# EAGLE schematic Divider (EAGLE 9.1.3)
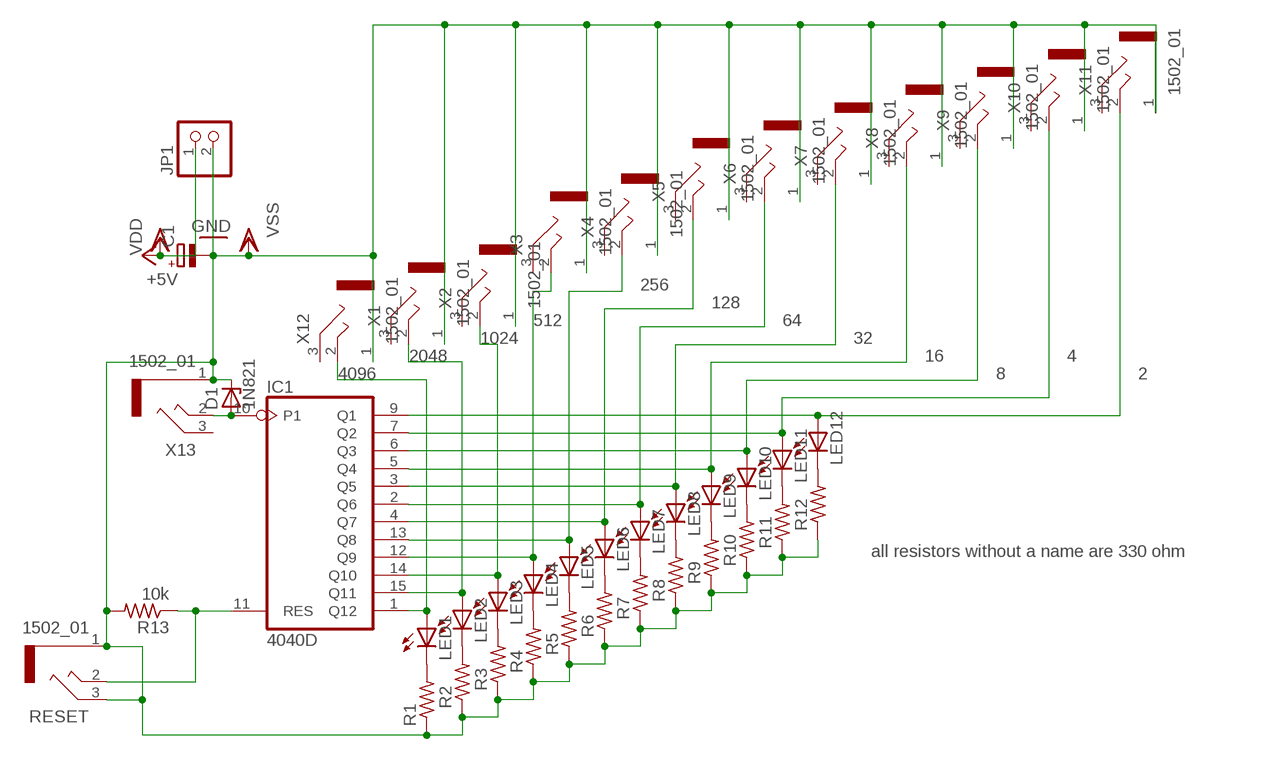
[diagram p0: schematic, sheet 1]

## Parts
C1  CPOL-EUE2,5-6E  [E2,5-6E]
D1  1N821  [DO35Z10]
IC1  4040D  [SO16]
JP1  PINHD-1X2  [1X02]
LED1  LED5MM  [LED5MM]
LED2  LED5MM  [LED5MM]
LED3  LED5MM  [LED5MM]
LED4  LED5MM  [LED5MM]
LED5  LED5MM  [LED5MM]
LED6  LED5MM  [LED5MM]
LED7  LED5MM  [LED5MM]
LED8  LED5MM  [LED5MM]
LED9  LED5MM  [LED5MM]
LED10  LED5MM  [LED5MM]
LED11  LED5MM  [LED5MM]
LED12  LED5MM  [LED5MM]
R1  R-US_0204/7  [0204/7]
R2  R-US_0204/7  [0204/7]
R3  R-US_0204/7  [0204/7]
R4  R-US_0204/7  [0204/7]
R5  R-US_0204/7  [0204/7]
R6  R-US_0204/7  [0204/7]
R7  R-US_0204/7  [0204/7]
R8  R-US_0204/7  [0204/7]
R9  R-US_0204/7  [0204/7]
R10  R-US_0204/7  [0204/7]
R11  R-US_0204/7  [0204/7]
R12  R-US_0204/7  [0204/7]
R13  10k  R-US_0204/7  [0204/7]
RESET  1502_01  [1502_01]
X1  1502_01  [1502_01]
X2  1502_01  [1502_01]
X3  1502_01  [1502_01]
X4  1502_01  [1502_01]
X5  1502_01  [1502_01]
X6  1502_01  [1502_01]
X7  1502_01  [1502_01]
X8  1502_01  [1502_01]
X9  1502_01  [1502_01]
X10  1502_01  [1502_01]
X11  1502_01  [1502_01]
X12  1502_01  [1502_01]
X13  1502_01  [1502_01]

## Nets
2: IC1.9(Q1) LED12.A X11.2
4: IC1.7(Q2) LED11.A X10.2
8: IC1.6(Q3) LED10.A X9.2
16: IC1.5(Q4) LED9.A X8.2
32: IC1.3(Q5) LED8.A X7.2
64: IC1.2(Q6) LED7.A X6.2
128: IC1.4(Q7) LED6.A X5.2
256: IC1.13(Q8) LED5.A X4.2
512: IC1.12(Q9) LED4.A X3.2
1024: IC1.14(Q10) LED3.A X2.2
2048: IC1.15(Q11) LED2.A X1.2
4096: IC1.1(Q12) LED1.A X12.2
N$1: IC1.11(RES) R13.1 RESET.2
N$14: D1.A IC1.10(P1) X13.2
N$15: LED1.K(C) R1.2
N$16: LED2.K(C) R2.2
N$17: LED3.K(C) R3.2
N$18: LED4.K(C) R4.2
N$19: LED5.K(C) R5.2
N$20: LED6.K(C) R6.2
N$21: LED7.K(C) R7.2
N$22: LED8.K(C) R8.2
N$23: LED9.K(C) R9.2
N$24: LED10.K(C) R10.2
N$25: LED11.K(C) R11.2
N$26: LED12.K(C) R12.2
VDD: C1.+ JP1.1 ; supply symbol labelled +5V
VSS: C1.- D1.C JP1.2 R1.1 R2.1 R3.1 R4.1 R5.1 R6.1 R7.1 R8.1 R9.1 R10.1 R11.1 R12.1 R13.2 RESET.1 RESET.3 X1.1 X2.1 X3.1 X4.1 X5.1 X6.1 X7.1 X8.1 X9.1 X10.1 X11.1 X12.1 X13.1 ; supply symbol labelled GND
Unconnected: X1.3 X2.3 X3.3 X4.3 X5.3 X6.3 X7.3 X8.3 X9.3 X10.3 X11.3 X12.3 X13.3

## Notes on the sheet
- all resistors without a name are 330 ohm

## Power pins joined to a net without a drawn wire
VDD: IC1.16(VDD)
VSS: IC1.8(VSS)

## Library data of the parts
C1 = resistor:CPOL-EU: POLARIZED CAPACITOR, European symbol
D1 = diode:1N821: Reference DIODE temperature compensated, 6,2 V
IC1 = 40xx:4040: 12-stage binary/ripple COUNTER
JP1 = pinhead:PINHD-1X2: PIN HEADER
LED1-LED12 = led:LED: LED OSRAM: - CHIPLED LG R971, LG N971, LY N971, LG Q971, LY Q971, LO R971, LY R971 LH N974, LH R974 LS Q976, LO Q976, LY Q976 LO Q996 - Hyper CHIPLED LW Q18S LB Q993, LB Q99A, LB R99A - SideLED LS A670, LO A670, LY A670, LG A670, LP A670 LB A673, LV A673, LT A673, LW A673 LH A674 LY A675 LS A676, LA A676, LO A676, LY A676, LW A676 LS A679, LY A679, LG A679 - Hyper Micro SIDELED® LS Y876, LA Y876, LO Y876, LY Y876 LT Y87S - SmartLED LW L88C, LW L88S LB L89C, LB L89S, LG L890 LS L89K, LO L89K, LY L89K LS L896, LA L896, LO L896, LY L896 - TOPLED LS T670, LO T670, LY T670, LG T670, LP T670 LSG T670, LSP T670, LSY T670, LOP T670, LYG T670 LG T671, LOG T671, LSG T671 LB T673, LV T673, LT T673, LW T673 LH T674 LS T676, LA T676, LO T676, LY T676, LB T676, LH T676, LSB T676, LW T676 LB T67C, LV T67C, LT T67C, LS T67K, LO T67K, LY T67K, LW E67C LS E67B, LA E67B, LO E67B, LY E67B, LB E67C, LV E67C, LT E67C LW T67C LS T679, LY T679, LG T679 LS T770, LO T770, LY T770, LG T770, LP T770 LB T773, LV T773, LT T773, LW T773 LH T774 LS E675, LA E675, LY E675, LS T675 LS T776, LA T776, LO T776, LY T776, LB T776 LHGB T686 LT T68C, LB T68C - Hyper Mini TOPLED® LB M676 - Mini TOPLED Santana® LG M470 LS M47K, LO M47K, LY M47K Source: http://www.osram.convergy.de LUXEON: - LUMILED® LXK2-PW12-R00, LXK2-PW12-S00, LXK2-PW14-U00, LXK2-PW14-V00 LXK2-PM12-R00, LXK2-PM12-S00, LXK2-PM14-U00 LXK2-PE12-Q00, LXK2-PE12-R00, LXK2-PE12-S00, LXK2-PE14-T00, LXK2-PE14-U00 LXK2-PB12-K00, LXK2-PB12-L00, LXK2-PB12-M00, LXK2-PB14-N00, LXK2-PB14-P00, LXK2-PB14-Q00 LXK2-PR12-L00, LXK2-PR12-M00, LXK2-PR14-Q00, LXK2-PR14-R00 LXK2-PD12-Q00, LXK2-PD12-R00, LXK2-PD12-S00 LXK2-PH12-R00, LXK2-PH12-S00 LXK2-PL12-P00, LXK2-PL12-Q00, LXK2-PL12-R00 Source: www.luxeon.com KINGBRIGHT: KA-3528ASYC Source: www.kingbright.com
R1-R13 = resistor:R-US_: RESISTOR, American symbol
RESET X1-X13 = con-lumberg:1502_01: Jack connectors according to JISC 6560, 3.5 mm Klinkensteckverbinder nach JISC 6560, 3,5 mm Source: http://www.lumberg.com/Produkte/PDFs/1502_01.pdf; OC_FARNELL: 4739747; OC_NEWARK: unknown